# EAGLE design MoWeSta-Weatherstation (EAGLE 9.5.2)
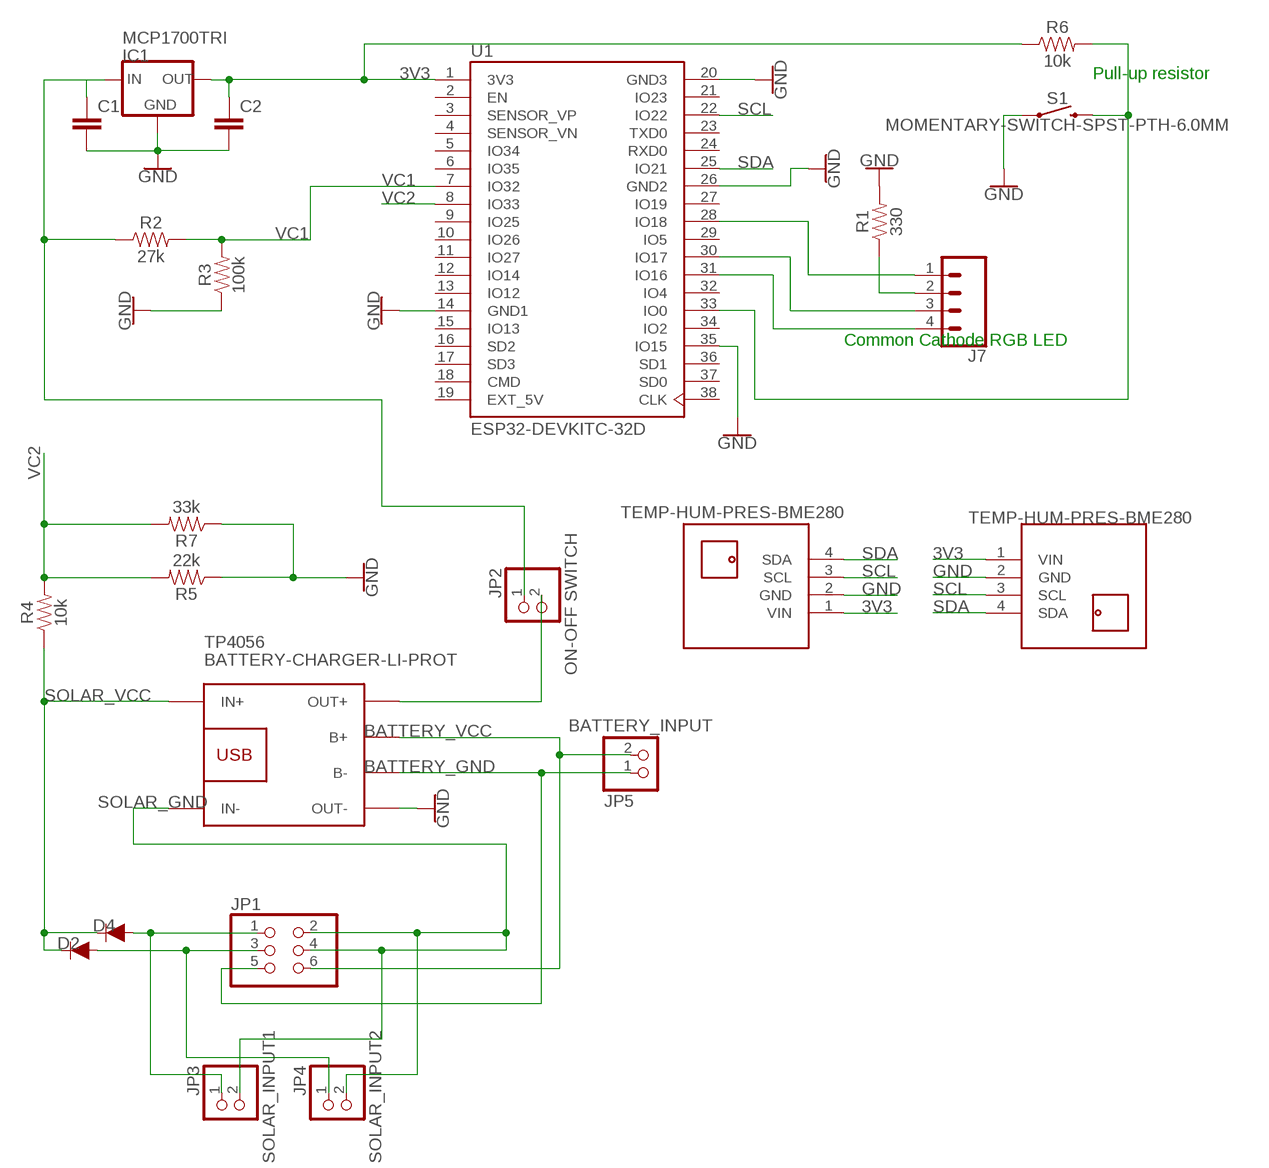
[diagram p0: schematic, sheet 1]

## Parts
C1  10nF  C-EU050-025X075  [C050-025X075]
C2  C-EU050-025X075  [C050-025X075]
D2  1A/50V/1.1V  DIODE-PTH  [DIODE-1N4001]
D4  1A/50V/1.1V  DIODE-PTH  [DIODE-1N4001]
IC1  MCP1700TRI  MCP1700INLINE  [TO92-INLINE]
J7  CONN_04  [1X04]
JP1  PINHD-2X3/90  [2X03/90]
JP2  ON-OFF SWITCH  PINHD-1X2  [1X02]
JP3  SOLAR_INPUT1  PINHD-1X2  [1X02]
JP4  SOLAR_INPUT2  PINHD-1X2  [1X02]
JP5  BATTERY_INPUT  PINHD-1X2  [1X02]
R1  330  1KOHM-HORIZ-1/4W-1%  [AXIAL-0.3]
R2  27k  1KOHM-HORIZ-1/4W-1%  [AXIAL-0.3]
R3  100k  1KOHM-HORIZ-1/4W-1%  [AXIAL-0.3]
R4  10k  1KOHM-HORIZ-1/4W-1%  [AXIAL-0.3]
R5  22k  1KOHM-HORIZ-1/4W-1%  [AXIAL-0.3]
R6  10k  1KOHM-HORIZ-1/4W-1%  [AXIAL-0.3]
R7  33k  1KOHM-HORIZ-1/4W-1%  [AXIAL-0.3]
S1  MOMENTARY-SWITCH-SPST-PTH-6.0MM  [TACTILE_SWITCH_PTH_6.0MM]
TP4056  BATTERY-CHARGER-LI-PROT  [BATTERY-CHARGER-LI-PROT]
U1  ESP32-DEVKITC-32D  [MODULE_ESP32-DEVKITC-32D]
U$3  TEMP-HUM-PRES-BME280  [TEMP-HUM-PRES-BME280]
U$4  TEMP-HUM-PRES-BME280  [TEMP-HUM-PRES-BME280]

## Nets
3V3: C2.1 IC1.3(OUT) R6.P$1 U1.1(3V3) U$3.1(VIN) U$4.1(VIN)
BATTERY_GND: JP1.5 JP5.1 TP4056.B-
BATTERY_VCC: JP1.6 JP5.2 TP4056.B+
GND: C1.2 C2.2 IC1.1(GND) R1.P$2 R3.P$1 R5.P$1 R7.P$1 S1.1 TP4056.OUT- U1.14(GND1) U1.20(GND3) U1.26(GND2) U1.35(IO15) U$3.2(GND) U$4.2(GND)
N$1: D2.A JP1.3 JP4.1
N$2: D4.A JP1.1 JP3.1
N$3: J7.2 R1.P$1
N$4: C1.1 IC1.2(IN) JP2.1 R2.P$1
N$6: J7.1 U1.28(IO18)
N$7: JP2.2 TP4056.OUT+
N$9: J7.4 U1.31(IO16)
N$10: R6.P$2 S1.3 U1.33(IO0)
N$14: J7.3 U1.30(IO17)
SCL: U1.22(IO22) U$3.3(SCL) U$4.3(SCL)
SDA: U1.25(IO21) U$3.4(SDA) U$4.4(SDA)
SOLAR_GND: JP1.2 JP1.4 JP3.2 JP4.2 TP4056.IN-
SOLAR_VCC: D2.C D4.C R4.P$1 TP4056.IN+
VC1: R2.P$2 R3.P$2 U1.7(IO32)
VC2: R4.P$2 R5.P$2 R7.P$2 U1.8(IO33)
Unconnected: U1.2(EN) U1.3(SENSOR_VP) U1.4(SENSOR_VN) U1.5(IO34) U1.6(IO35) U1.9(IO25) U1.10(IO26) U1.11(IO27) U1.12(IO14) U1.13(IO12) U1.15(IO13) U1.16(SD2) U1.17(SD3) U1.18(CMD) U1.21(IO23) U1.23(TXD0) U1.24(RXD0) U1.27(IO19) U1.29(IO5) U1.32(IO4) U1.34(IO2) U1.36(SD1) U1.37(SD0) U1.38(CLK)

## Notes on the sheet
- Pull-up resistor
- Common Cathode RGB LED

## Power pins joined to a net without a drawn wire
EXT_5V: U1.19(EXT_5V)

## Library data of the parts
C1 C2 = rcl:C-EU: CAPACITOR, European symbol; SPICEPREFIX: C
D2 D4 = SparkFun-DiscreteSemi:DIODE: Diode These are standard reverse protection diodes and small signal diodes. SparkFun Products: SparkFun SparkPunk Sound Kit <https://www.sparkfun.com/products/11177> SparkFun ESP8266 Thing <https://www.sparkfun.com/products/13231>; PROD_ID: DIO-09176
IC1 = adafruit:MCP1700: VOLTAGE REGULATOR
J7 = SparkFun-Connectors:CONN_04: Multi connection point. Often used as Generic Header-pin footprint for 0.1 inch spaced/style header connections On any of the 0.1 inch spaced packages, you can populate with these: Break Away Headers - Straight <https://www.sparkfun.com/products/116> (PRT-00116) Break Away Male Headers - Right Angle <https://www.sparkfun.com/products/553> (PRT-00553) Female Headers <https://www.sparkfun.com/products/115> (PRT-00115) Break Away Headers - Machine Pin <https://www.sparkfun.com/products/117> (PRT-00117) Break Away Female Headers - Swiss Machine Pin <https://www.sparkfun.com/products/743> (PRT-00743) For SCREWTERMINALS and SPRING TERMINALS visit here: Screw Terimnals on SparkFun.com <https://www.sparkfun.com/search/results?term=Screw+Terminals> (5mm/3.5mm/2.54mm spacing) This device is also useful as a general connection point to wire up your design to another part of your project. Our various solder wires solder well into these plated through hole pads. Hook-Up Wire - Assortment (Stranded, 22 AWG) <https://www.sparkfun.com/products/11375> (PRT-11375) Hook-Up Wire - Assortment (Solid Core, 22 AWG) <https://www.sparkfun.com/products/11367> (PRT-11367) View the entire wire category on our website here <https://www.sparkfun.com/categories/141> Special notes: Molex polarized connector foot print use with SKU : PRT-08231 with associated crimp pins and housings. 1MM SMD Version SKU: PRT-10208; PROD_ID: CONN-09696
JP1 = pinhead:PINHD-2X3: PIN HEADER
JP2-JP5 = pinhead:PINHD-1X2: PIN HEADER
R1-R7 = SparkFun-Resistors:1KOHM: 1kΩ resistor A resistor is a passive two-terminal electrical component that implements electrical resistance as a circuit element. Resistors act to reduce current flow, and, at the same time, act to lower voltage levels within circuits. - Wikipedia; PROD_ID: RES-12182; VALUE: 1k
S1 = SparkFun-Switches:MOMENTARY-SWITCH-SPST: Momentary Switch (Pushbutton) - SPST Normally-open (NO) SPST momentary switches (buttons, pushbuttons). Variants PTH-12MM - 12mm square, through-hole Momentary Pushbutton Switch - 12mm Square <https://www.sparkfun.com/products/9190> (COM-09190) PTH-6.0MM, PTH-6.0MM-KIT - 6.0mm square, through-hole Mini Pushbutton Switch <https://www.sparkfun.com/products/97> (COM-00097) KIT package intended for soldering kit's - only one side of pads' copper is exposed. PTH-RIGHT-ANGLE-KIT - Right-angle, through-hole Right Angle Tactile Button <https://www.sparkfun.com/products/10791> - Used on SparkFun BigTime Watch Kit <https://www.sparkfun.com/products/11734> SMD-12MM - 12mm square, surface-mount Tactile Button - SMD (12mm) <https://www.sparkfun.com/products/12993> (COM-12993) Used on SparkFun PicoBoard <https://www.sparkfun.com/products/11888> SMD-4.5MM - 4.5mm Square Trackball Switch Used on SparkFun Blackberry Trackballer Breakout <https://www.sparkfun.com/products/13169> SMD-4.6MMX2.8MM - 4.60mm x 2.80mm, surface mount Used on SparkFun SAMD21 Mini Breakout <https://www.sparkfun.com/products/13664> SMD-5.2MM, SMD-5.2-REDUNDANT - 5.2mm square, surface-mount Mini Pushbutton Switch - SMD <https://www.sparkfun.com/products/8720> (COM-08720) Used on Arduino Pro Mini <https://www.sparkfun.com/products/11114> REDUNDANT package connects both switch circuits together SMD-6.0X3.5MM - 6.0 x 3.5mm, surface mount Momentary Reset Switch SMD <https://www.sparkfun.com/products/8229> (COM-08229) SMD-6.2MM-TALL - 6.2mm square, surface mount Tactile Button - SMD (6mm) <https://www.sparkfun.com/products/12992> Used on SparkFun Digital Sandbox <https://www.sparkfun.com/products/12651> SMD-RIGHT-ANGLE - Right-angle, surface mount Used on SparkFun Block for Intel® Edison - Arduino <https://www.sparkfun.com/products/13036>; PROD_ID: SWCH-08441; SF_SKU: COM-00097
TP4056 = diy-modules_tp4056:BATTERY-CHARGER-LI-PROT: Lithium Battery 5V Charger with protection circuit More details available here: http://www.instructables.com/id/DIY-Lithium-ion-Battery-Charger/step4/TP4056-based-lithium-ion-battery-charger-module/ Click here to find device on ebay.com <http://www.ebay.com/sch/tp4056+charger+usb+protection>
U1 = ESP32-DEVKITC-32D_new:ESP32-DEVKITC-32D: Eval Board For Esp-Wroom-32; AVAILABILITY: Unavailable; DESCRIPTION: EVAL BOARD FOR ESP-WROOM-32; MF: Espressif Systems; MP: ESP32-DEVKITC-32D; PACKAGE: None; PRICE: None
U$3 U$4 = diy-modules:TEMP-HUM-PRES-BME280: Digital Humidity-Temperature-Pressure Sensor based on BME280 device More information about BME280 device is available here: https://www.bosch-sensortec.com/bst/products/all_products/bme280 Click here to find device on ebay.com <http://www.ebay.com/sch/bme280+breakout>

## Board
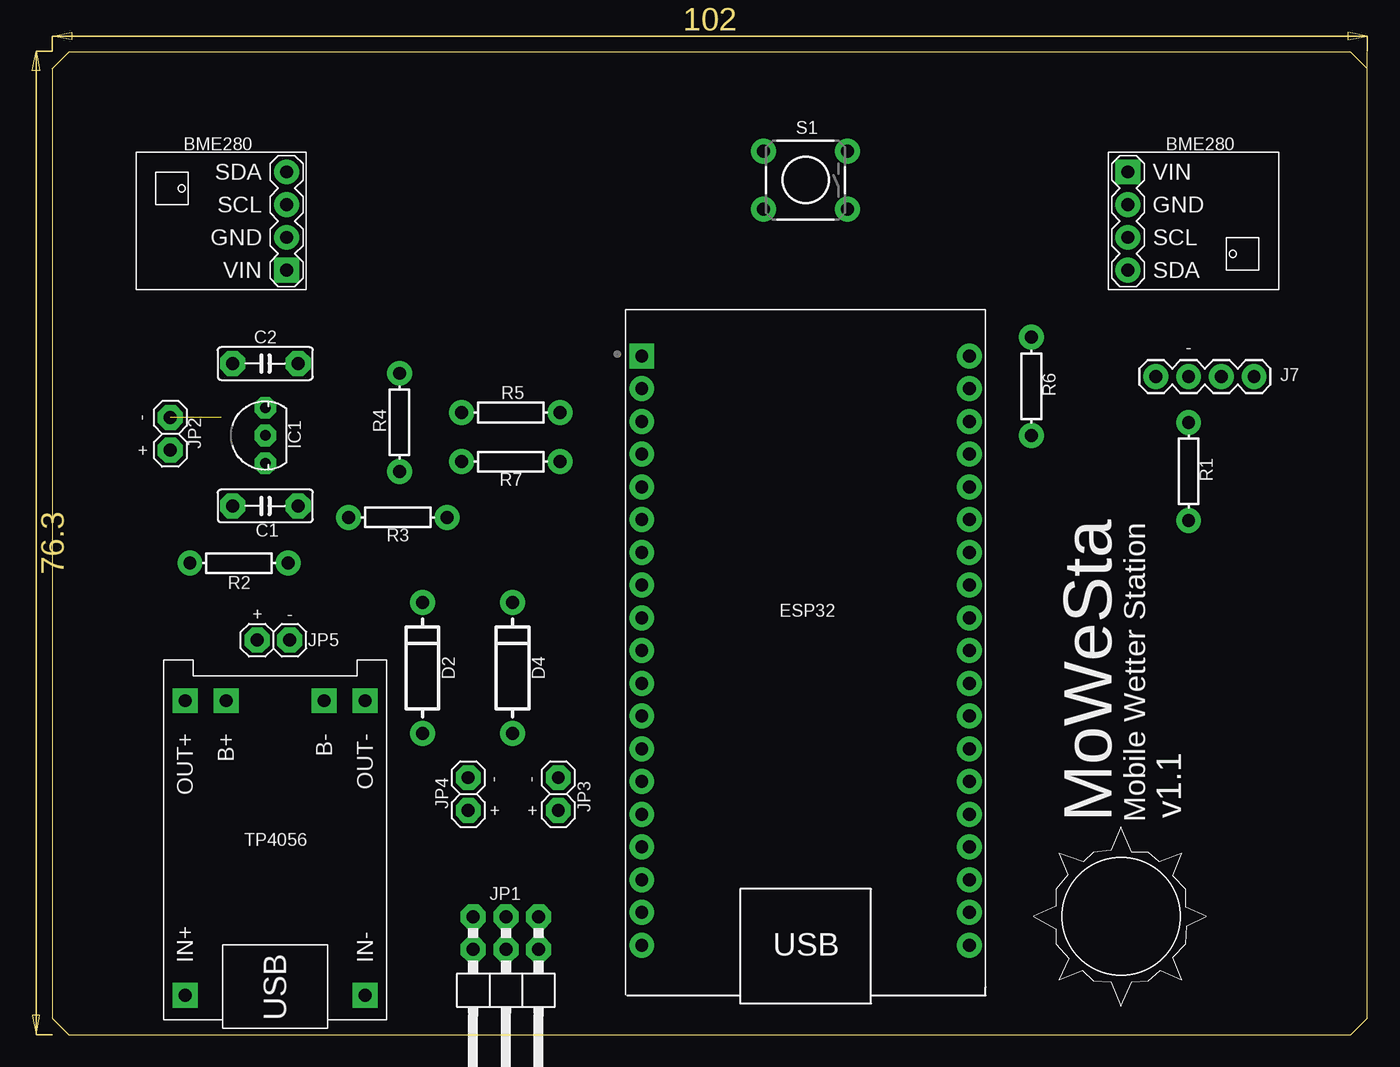
[diagram p1: board, top side]
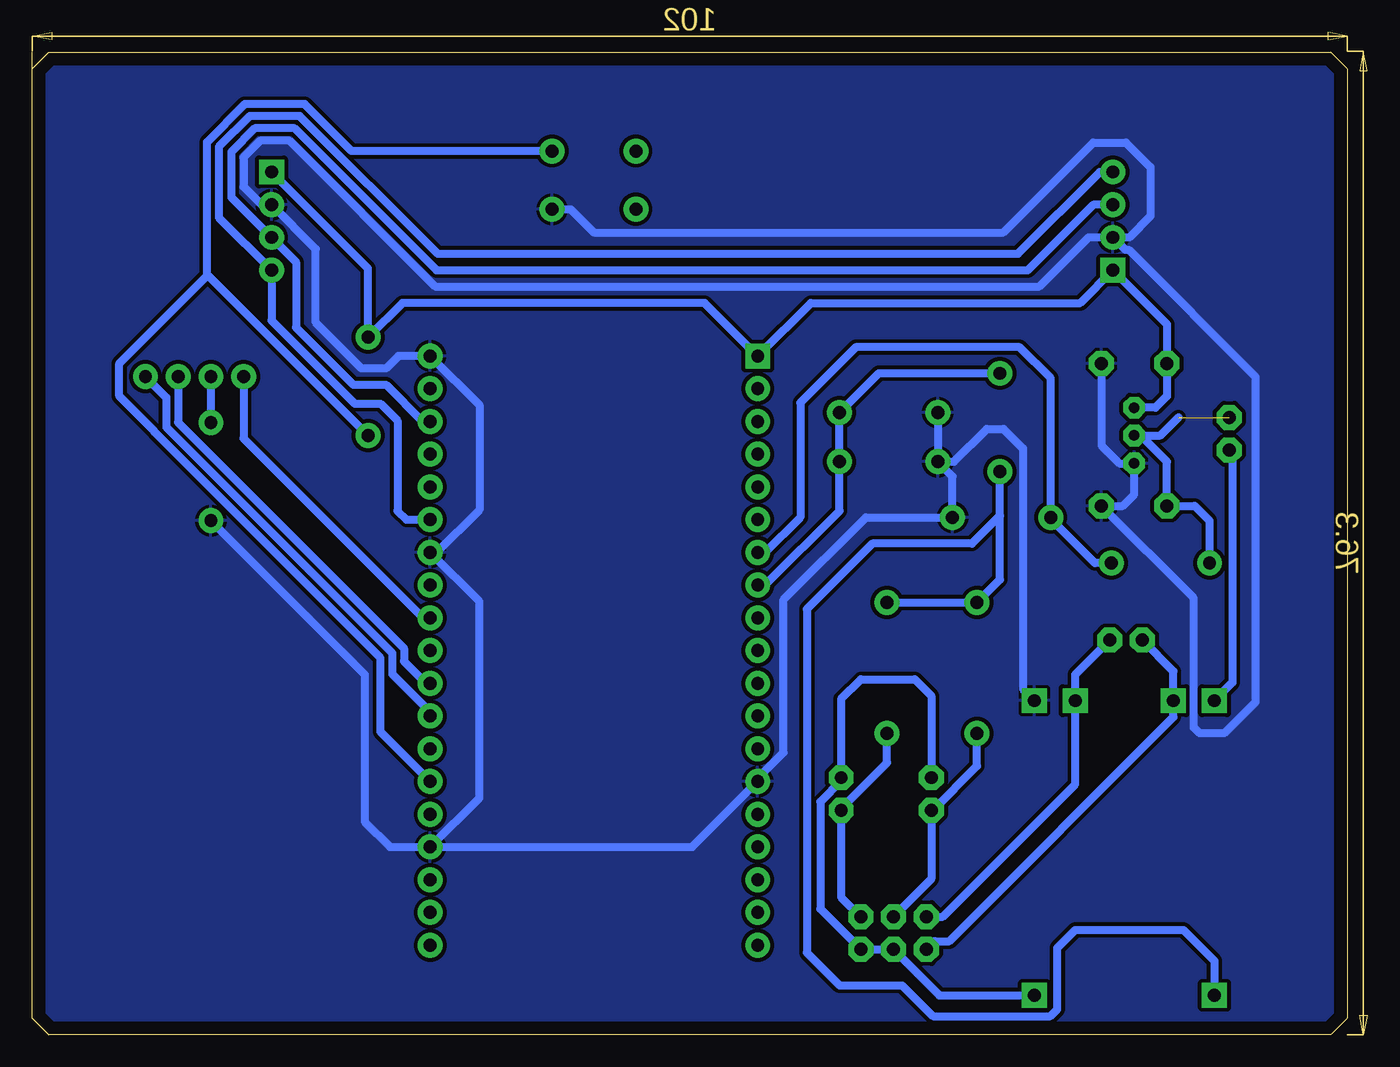
[diagram p2: board, bottom side, seen from below]

Size 101.98 x 76.2 mm. Coordinates in mm from the lower left corner, seen from the top.
Outline: 101.98,74.93 101.98,1.27 100.71,0 1.27,0 0,1.27 0,74.93 1.27,76.2 100.71,76.2 101.98,74.93
Outline: 101.98,74.93 101.98,76.2
Copper layers (1*16): Top 0.035mm / dielectric 1.5mm / Bottom 0.035mm
Design rules "default *": minimum track width 6mil, minimum drill 0.7mm, track to track 12mil, track to pad 12mil, pad to pad 12mil, via to via 12mil, smd to smd 12mil, copper to edge 40mil, drill to drill 6mil, minimum pad ring 10mil, minimum via ring 8mil, stop-mask expansion 4mil, vias tented up to drill 0mil, thermal gap 10mil

### Footprints (pad centres in the part's own frame; a part is rotated, then mirrored left to right if it is on the bottom)
C050-025X075 = drill 1 pad 1.93 octagon: 1 -2.54,0; 2 2.54,0
DIODE-1N4001 = drill 1 pad 1.93: A -5.08,0; C 5.08,0
TO92-INLINE = drill 0.813 pad 1.676 octagon: 1 -2.159,0; 2 0,0; 3 2.159,0
1X04 = drill 1 pad 1.93: 1 0,0; 2 2.54,0; 3 5.08,0; 4 7.62,0
2X03/90 = drill 1 pad 1.93 octagon: 1 -2.54,-6.35; 2 -2.54,-3.81; 3 0,-6.35; 4 0,-3.81; 5 2.54,-6.35; 6 2.54,-3.81
1X02 = drill 1 pad 1.93 octagon: 1 -1.27,0; 2 1.27,0
AXIAL-0.3 = drill 1 pad 1.93: P$1 -3.81,0; P$2 3.81,0
TACTILE_SWITCH_PTH_6.0MM = drill 1 pad 1.93: 1 -3.251,2.261; 2 3.251,2.261; 3 -3.251,-2.261; 4 3.251,-2.261
BATTERY-CHARGER-LI-PROT = drill 1 pad 1.93 square: B+ 10.795,3.81; B- 10.795,-3.81; IN+ -12.065,6.985; IN- -12.065,-6.985; OUT+ 10.795,6.985; OUT- 10.795,-6.985
MODULE_ESP32-DEVKITC-32D = drill 1 pad 1.93 square: 1 -12.7,19.76 | drill 1 pad 1.93: 2 -12.7,17.22; 3 -12.7,14.68; 4 -12.7,12.14; 5 -12.7,9.6; 6 -12.7,7.06; 7 -12.7,4.52; 8 -12.7,1.98; 9 -12.7,-0.56; 10 -12.7,-3.1; 11 -12.7,-5.64; 12 -12.7,-8.18; 13 -12.7,-10.72; 14 -12.7,-13.26; 15 -12.7,-15.8; 16 -12.7,-18.34; 17 -12.7,-20.88; 18 -12.7,-23.42; 19 -12.7,-25.96; 20 12.7,19.76; 21 12.7,17.22; 22 12.7,14.68; 23 12.7,12.14; 24 12.7,9.6; 25 12.7,7.06; 26 12.7,4.52; 27 12.7,1.98; 28 12.7,-0.56; 29 12.7,-3.1; 30 12.7,-5.64; 31 12.7,-8.18; 32 12.7,-10.72; 33 12.7,-13.26; 34 12.7,-15.8; 35 12.7,-18.34; 36 12.7,-20.88; 37 12.7,-23.42; 38 12.7,-25.96
TEMP-HUM-PRES-BME280 = drill 1 pad 1.93 square: 1 -5.08,3.81 | drill 1 pad 1.93: 2 -5.08,1.27; 3 -5.08,-1.27; 4 -5.08,-3.81

### Placement (x,y rotation side)
C1  16.51,41.02 0 top
C2  16.51,52.07 0 top
D2  28.7,28.45 90 top
D4  35.69,28.45 90 top
IC1  16.51,46.48 90 top
J7  85.6,51.05 0 top
JP1  35.18,2.79 180 top
JP2  9.14,46.61 270 top
JP3  39.24,18.67 90 top
JP4  32.26,18.67 90 top
JP5  17.15,30.61 180 top
R1  88.14,43.69 270 top
R2  14.48,36.58 0 top
R3  26.8,40.13 180 top
R4  26.92,47.5 90 top
R5  35.56,48.26 0 top
R6  75.95,50.29 270 top
R7  35.56,44.45 0 top
S1  58.42,66.29 180 top
TP4056  17.27,15.11 90 top
U1  58.42,32.89 0 top
U$3  13.08,63.12 180 top
U$4  88.52,63.12 0 top

### Tracks (layer width: path | path; a pad name or v marks a point on that pad's centre or on a via)
3V3
  Bottom 0.61: IC1.3 14.86,48.64 13.97,49.53 C2.1 13.97,55.12 U$3.1 20.7,56.77 41.6,56.77 U1.1 49.84,56.77 73.28,56.77 R6.P$1 75.95,59.44 U$4.1
BATTERY_GND
  Bottom 0.61: JP1.5 31.37,9.14 21.08,19.43 TP4056.B- 21.08,27.94 JP5.1
BATTERY_VCC
  Bottom 0.61: JP1.6 32,7.24 30.86,7.24 13.46,24.64 TP4056.B+ 13.46,28.19 JP5.2
GND
  Bottom 0.61: U1.35 50.8,14.55 U1.14 45.72,19.87 43.71,21.88 43.71,33.76 37.34,40.13 R3.P$1 30.61,43.31 R7.P$1 | U$3.2 20.07,61.85 23.88,58.04 70.74,58.04 82.04,69.34 84.33,69.34 85.6,68.07 85.6,65.79 84.2,64.39 U$4.2 80.01,60.96 80.01,55.24 76.45,51.69 74.55,51.69 73.59,52.65 U1.20 67.31,48.84 67.31,40.71 70.61,37.41 U1.26 67.31,33.6 67.31,18.36 U1.35 | R5.P$1 R7.P$1 | R7.P$1 30.48,44.45 27.94,46.99 26.66,46.99 25.15,45.48 25.15,26.8 TP4056.OUT- | C2.2 19.05,45.72 17.65,44.32 IC1.1 16.51,41.91 17.4,41.02 C1.2 11.89,33.86 11.89,23.83 11.43,23.37 9.53,23.37 7.11,25.78 7.11,51.05 16.94,60.88 17.2,60.88 U$3.2 | S1.1 60.22,64.03 58.42,62.23 26.67,62.23 19.69,69.22 17.15,69.22 15.24,67.31 15.24,63.5 16.89,61.85 U$3.2 | R1.P$2 76.2,27.94 76.2,16.51 74.24,14.55 U1.35
  pour Bottom: 0,74.93 1.27,76.2 100.33,76.2 100.71,76.2 101.98,74.93 101.98,1.27 100.71,0 1.27,0 0,1.27
N$1
  Bottom 0.61: JP1.3 32.26,12.07 JP4.1 32.13,17.4 28.7,20.83 D2.A
N$2
  Bottom 0.61: D4.A 35.69,21.08 39.24,17.53 JP3.1 39.24,10.67 JP1.1
N$3
  Bottom 0.61: J7.2 R1.P$1
N$4  (1 unrouted)
  Bottom 0.61: R2.P$1 10.67,39.88 11.81,41.02 C1.1 13.97,44.45 16,46.48 IC1.2 14.48,46.48 13.08,47.88
N$6
  Bottom 0.61: J7.1 85.6,46.25 71.68,32.33 U1.28
N$7
  Bottom 0.61: TP4056.OUT+ 8.89,27.3 8.89,45.09 JP2.2
N$9
  Bottom 0.61: J7.4 91.59,49.43 91.59,47.12 74.07,29.59 74.07,27.97 71.12,25.03 U1.31
N$10
  Bottom 0.61: S1.3 77.23,68.56 80.86,72.19 85.51,72.19 88.44,69.25 88.44,58.88 | U1.33 74.98,23.49 74.98,29.21 92.51,46.74 92.51,46.79 95.25,49.53 95.25,52.07 88.44,58.88 | R6.P$2 88.34,58.88 88.44,58.88
N$14
  Bottom 0.61: J7.3 90.68,47.5 73.15,29.97 73.15,28.96 71.45,27.25 U1.30
SCL
  Bottom 0.61: U1.22 71.7,47.57 74.55,50.42 77.09,50.42 81.53,54.86 81.53,59.94 U$4.3 86.56,64.97 86.56,68.47 84.73,70.31 81.64,70.31 70.64,59.31 24.77,59.31 19.69,64.39 U$3.3
SDA
  Bottom 0.61: U$3.4 19.18,66.93 25.53,60.58 70.55,60.58 81.24,71.27 85.13,71.27 87.53,68.87 87.53,63.4 U$4.4 83.44,55.4 76.98,48.95 74.98,48.95 73.66,47.63 73.66,40.64 72.97,39.95 U1.25
SOLAR_GND
  Bottom 0.61: TP4056.IN- 31.62,3.05 JP1.4 JP1.2 40.87,9.75 40.87,18.07 39.24,19.7 JP3.2 39.24,26.04 37.72,27.56 33.53,27.56 32.26,26.29 JP4.2
SOLAR_VCC
  Bottom 0.61: D4.C D2.C 26.92,35.31 26.92,40.26 | 26.92,40.26 29.08,38.1 36.83,38.1 41.91,33.02 41.91,6.35 39.37,3.81 34.51,3.81 32.12,1.42 23.02,1.42 22.48,1.96 22.48,6.73 21.08,8.13 12.7,8.13 10.29,5.71 TP4056.IN+ | 26.92,40.26 R4.P$1
VC1
  Bottom 0.61: R2.P$2 19.56,36.58 22.99,40.01 R3.P$2 22.99,50.93 25.4,53.34 38.1,53.34 42.42,49.02 42.42,40.13 45.14,37.41 U1.7
VC2
  Bottom 0.61: U1.8 45.14,34.87 39.37,40.64 R7.P$2 R5.P$2 36.32,51.31 R4.P$2

### Text on the board
tPlace: S1 | BME280 | BME280 | C2 | - | J7 | R5 | R6 | - | R4 | JP2 | IC1 | + | R7 | R1 | C1 | R3 | R2 | + | - | ESP32 | JP5 | MoWeSta | Mobile Wetter Station | D2 | D4 | - | - | JP3 | v1.1 | JP4 | + | + | TP4056 | JP1